# Altium schematic sheet 05 ADC.SchDoc
size A4
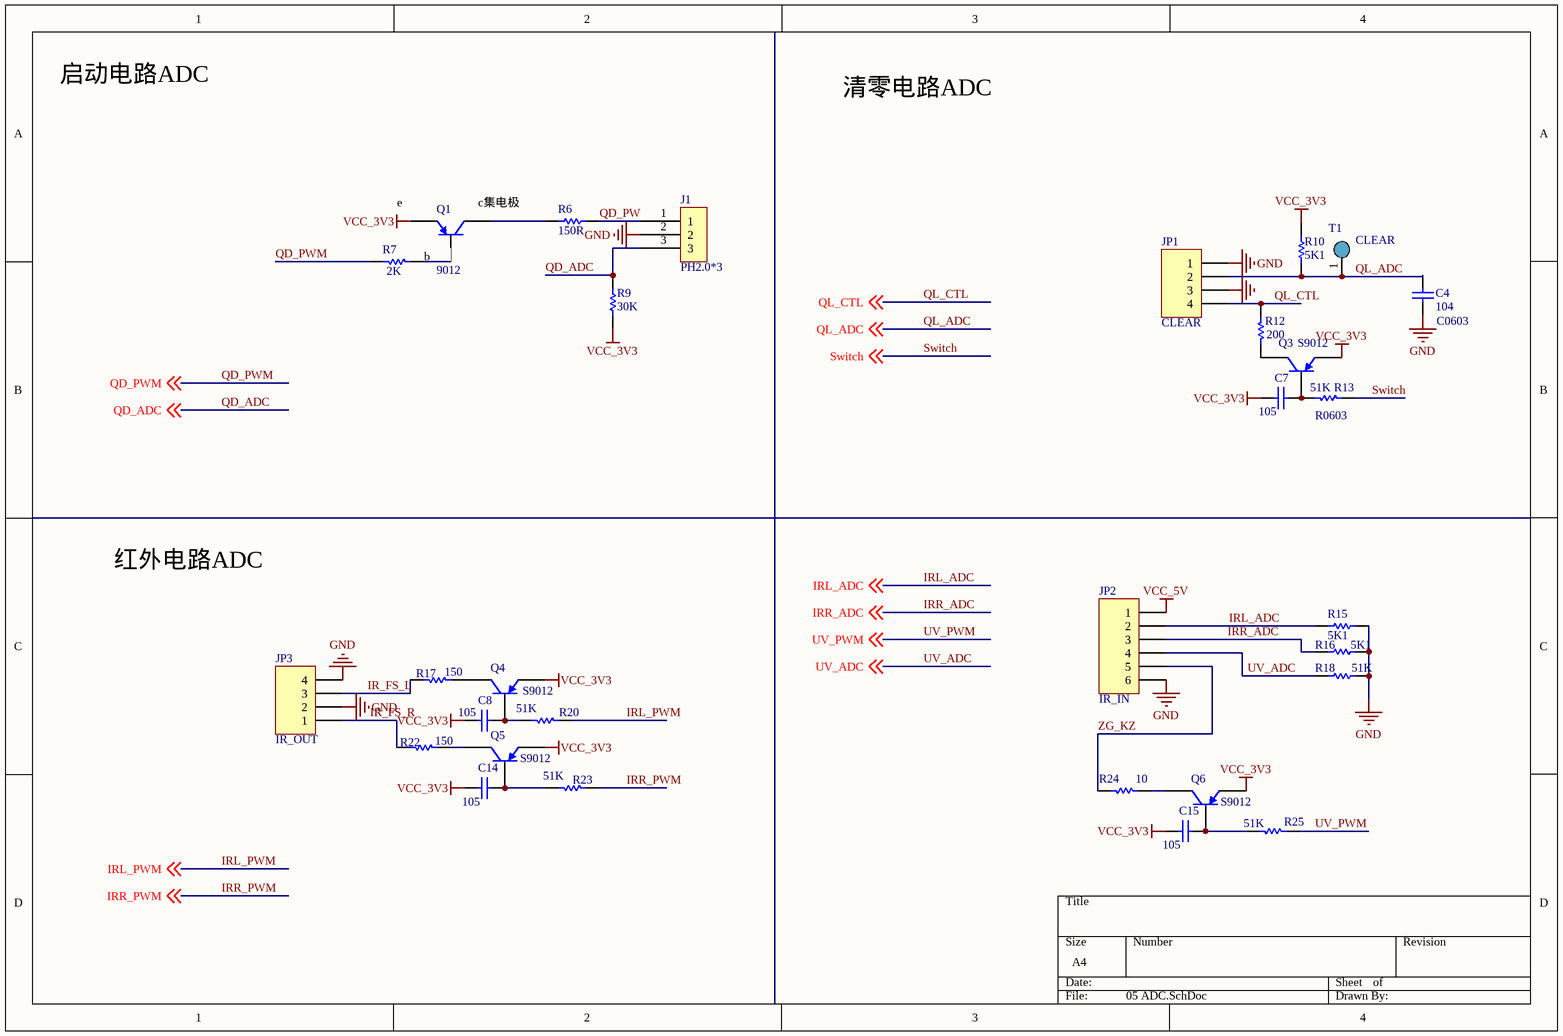
[diagram p0: 05 ADC.SchDoc]

## Parts
C4  104  [C0603]
C7  105  [C0603]
C8  105  [C0603]
C14  105  [C0603]
C15  105  [C0603]
J1  PH2.0*3  [PH2.0*3]
JP1  CLEAR  [PH2.0*4]
JP2  IR_IN  [PH2.0*6]
JP3  IR_OUT  [PH2.0*4]
Q1  9012  [PNP-SOT-23]
Q3  S9012  [PNP-SOT-23]
Q4  S9012  [PNP-SOT-23]
Q5  S9012  [PNP-SOT-23]
Q6  S9012  [PNP-SOT-23]
R6  150R  [R0603]
R7  2K  [R0603]
R9  30K  [R0603]
R10  5K1  [R0603]
R12  200  [R0603]
R13  51K  [R0603]
R15  5K1  [R0603]
R16  5K1  [R0603]
R17  150  [R0603]
R18  51K  [R0603]
R20  51K  [R0603]
R22  150  [R0603]
R23  51K  [R0603]
R24  10  [R0603]
R25  51K  [R0603]
T1  CLEAR  [测试点]

## Nets
GND: C4.2 J1.2 JP1.1 JP1.3 JP2.6 JP3.2 JP3.4 R15.2 R16.2 R18.2
VCC_3V3: C7.1 C8.2 C14.1 C15.1 Q1.1(E) Q3.1(E) Q4.1(E) Q5.1(E) Q6.1(E) R9.2 R10.1
VCC_5V: JP2.1
IR_FS_L: JP3.3 R17.2
IR_FS_R: JP3.1 R22.2
IRL_ADC: JP2.2 R15.1 ; off-sheet IRL_ADC
IRL_PWM: R20.1 ; off-sheet IRL_PWM
IRR_ADC: JP2.3 R16.1 ; off-sheet IRR_ADC
IRR_PWM: R23.1 ; off-sheet IRR_PWM
QD_ADC: J1.3 R9.1 ; off-sheet QD_ADC
QD_PW: J1.1 R6.2
QD_PWM: R7.2 ; off-sheet QD_PWM
QL_ADC: C4.1 JP1.2 R10.2 T1.1 ; off-sheet QL_ADC
QL_CTL: JP1.4 R12.1 ; off-sheet QL_CTL
Switch: R13.1 ; off-sheet Switch
UV_ADC: JP2.4 R18.1 ; off-sheet UV_ADC
UV_PWM: R25.1 ; off-sheet UV_PWM
ZG_KZ: JP2.5 R24.2
NetC7_2: C7.2 Q3.2(B) R13.2
NetC8_1: C8.1 Q4.2(B) R20.2
NetC14_2: C14.2 Q5.2(B) R23.2
NetC15_2: C15.2 Q6.2(B) R25.2
NetQ1_2: Q1.2(B) R7.1
NetQ1_3: Q1.3(C) R6.1
NetQ3_3: Q3.3(C) R12.2
NetQ4_3: Q4.3(C) R17.1
NetQ5_3: Q5.3(C) R22.1
NetQ6_3: Q6.3(C) R24.1

## Notes on the sheet
- 启动电路ADC
- 清零电路ADC
- (near Q1) e
- c集电极
- b
- 红外电路ADC

## Library data of the parts
C4 = Cap: Capacitor; Manufacturer: Generic Components; Class: Passive; Value: 105; Published: 08/06/2000; Publisher: Altium Hobart Technology Centre; SubClass: Capacitor
C7 C8 C14 C15 = Cap: Capacitor; Manufacturer: Generic Components; Class: Passive; Published: 08/06/2000; Publisher: Altium Hobart Technology Centre; SubClass: Capacitor; Value: 105
JP1 = Header 4: Header, 4-Pin; LatestRevisionDate: 17-Jul-2002; LatestRevisionNote: Re-released for DXP Platform.; Publisher: Altium Limited
JP2 = Header 6: Header, 6-Pin; LatestRevisionDate: 17-Jul-2002; LatestRevisionNote: Re-released for DXP Platform.; Publisher: Altium Limited
JP3 = Header 4: Header, 4-Pin; Manufacturer: Generic Components; Class: Connector
Q1 Q3-Q6 = 2N3906: PNP General Purpose Amplifier; Published: 8-Jun-2000; LatestRevisionDate: 15-Jan-2003; LatestRevisionNote: PCB Footprint 'BCY-W3/D4.7' replaced; PackageReference: TO-92A; Publisher: Altium Limited; Code_JEDEC: TO-92A
  Q1: DatasheetVersion: 1997; PackageVersion: Sep-1998; ComponentLink1Description: Manufacturer Link; ComponentLink1URL: http://www.fairchildsemi.com/; ComponentLink2Description: Datasheet; ComponentLink2URL: http://www.fairchildsemi.com/ds/2N%2F2N3906.pdf
  Q3-Q6: DatasheetDocument: 1997; PackageDocument: Sep-1998
R6 R9 = Res1: Resistor; Value: 1K; Published: 8-Jun-2000; LatestRevisionDate: 17-Jul-2002; LatestRevisionNote: Re-released for DXP Platform.; PackageReference: AXIAL-0.3; Publisher: Altium Limited; PackageDescription: Axial Device, Thru-Hole; 2 Leads; 0.3 in Pin Spacing
R7 = Res1: Resistor; Manufacturer: Generic Components; Class: Passive; Value: 1K; Published: 08/06/2000; Publisher: Altium Hobart Technology Centre; SubClass: Resistor
R10 R15 R16 R18 = Res1: Resistor; Manufacturer: Generic Components; Class: Passive; Value: 5.1K; Published: 08/06/2000; Publisher: Altium Hobart Technology Centre; SubClass: Resistor
R12 = Res1: Resistor; Manufacturer: Generic Components; Class: Passive; Value: 510; Published: 08/06/2000; Publisher: Altium Hobart Technology Centre; SubClass: Resistor
R13 = Res1: Resistor; Manufacturer: Generic Components; Class: Passive; Value: 2K; Published: 08/06/2000; Publisher: Altium Hobart Technology Centre; SubClass: Resistor
R17 R20 R22 R23 R25 = Res1: Resistor; Manufacturer: Generic Components; Class: Passive; Published: 08/06/2000; Publisher: Altium Hobart Technology Centre; SubClass: Resistor
  R17 R22: Value: 150
  R20 R23 R25: Value: 51K
R24 = Res1: Resistor; Manufacturer: Generic Components; Class: Passive; Value: 150; Published: 08/06/2000; Publisher: Altium Hobart Technology Centre; SubClass: Resistor
T1 = DIAN